# Altium schematic sheet Schematic_puente.SchDoc
size A4
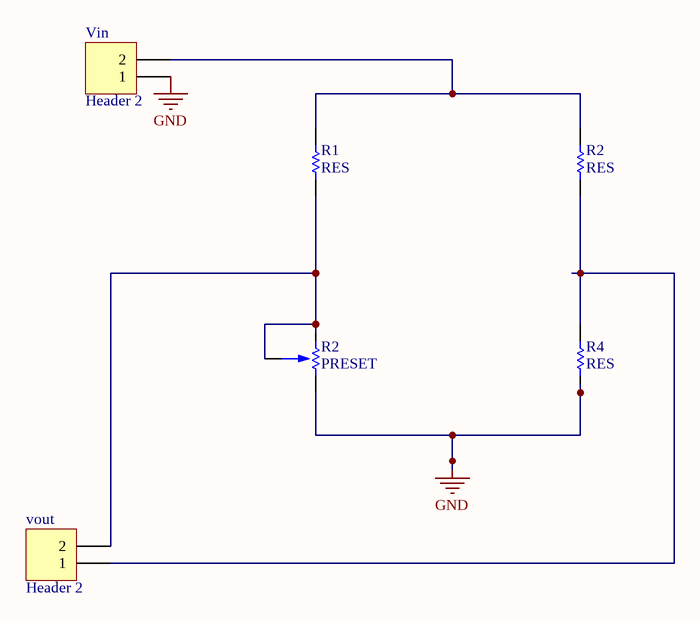
[diagram p0: Schematic_puente.SchDoc]

## Parts
(Parts that share a designator on the sheet are numbered #1, #2 ... from top to bottom, then left to right.)
R1  RES  [0805]
R2#1  RES  [0805]
R2#2  PRESET  [PRESET V]
R4  RES  [0805]
Vin  Header 2  [HDR1X2]
vout  Header 2  [HDR1X2]

## Nets
GND: R2#2.1 R4.1 Vin.1
NetR1_1: R1.1 R2#2.2 R2#2.3 vout.2
NetR1_2: R1.2 R2#1.2 Vin.2
NetR2#1_1: R2#1.1 R4.2 vout.1

## Library data of the parts
Vin vout = Header 2: Header, 2-Pin; LatestRevisionDate: 17-Jul-2002; LatestRevisionNote: Re-released for DXP Platform.; Publisher: Altium Limited